# Altium schematic sheet STM32主控模块.SchDoc
size A3
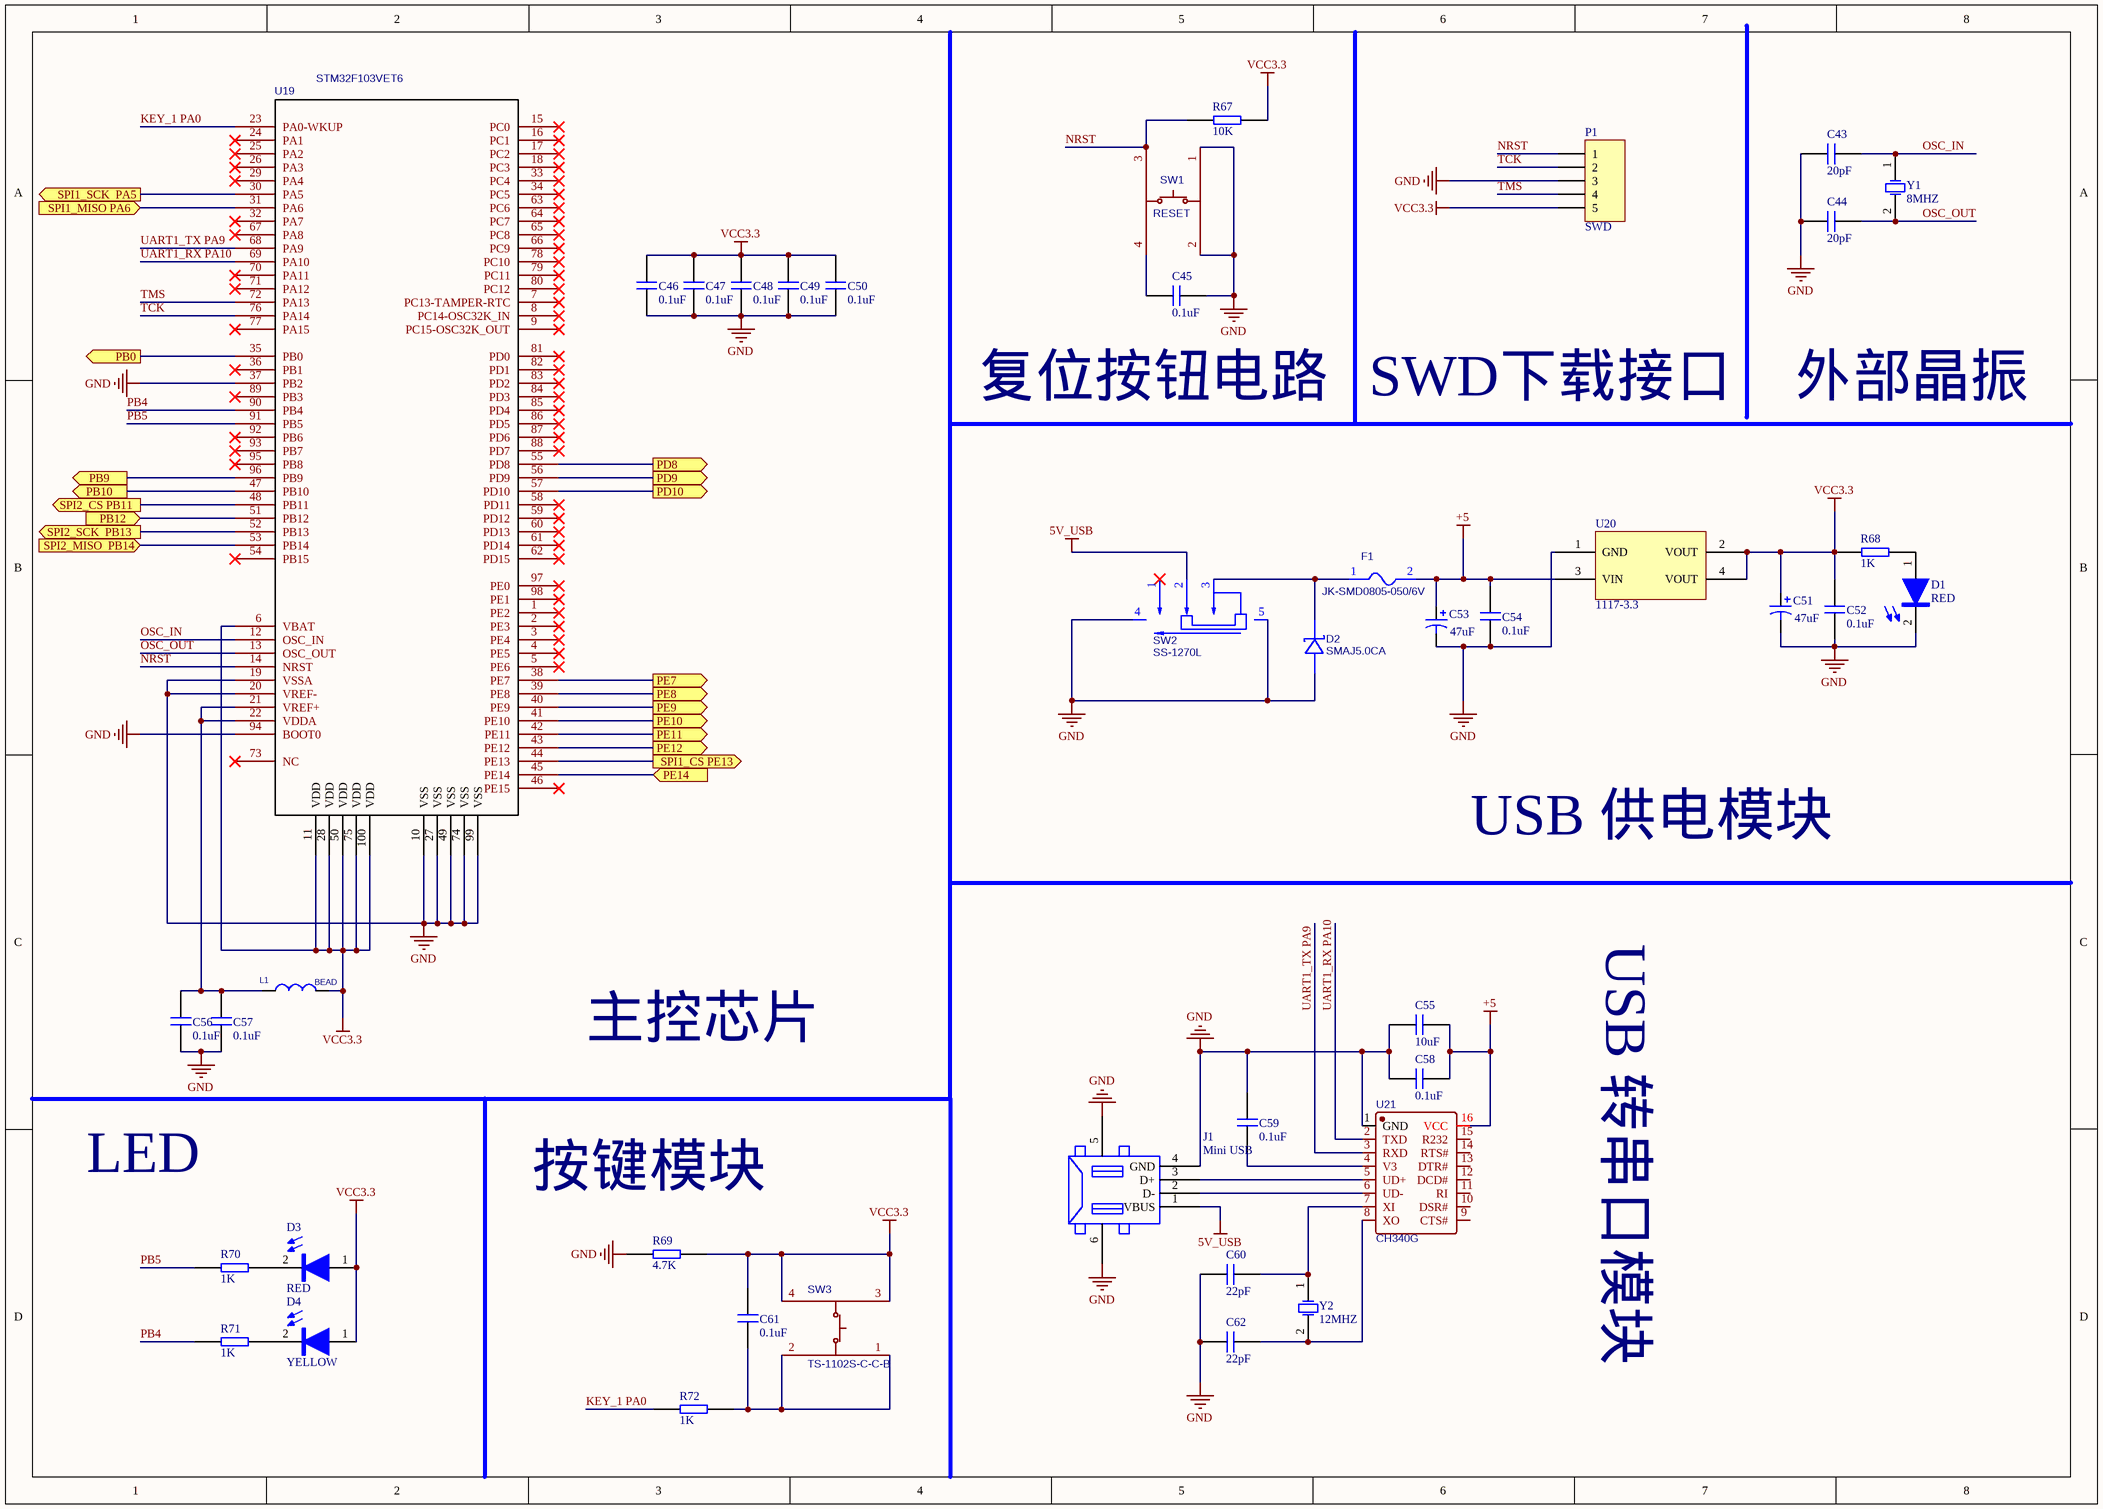
[diagram p0: STM32主控模块.SchDoc]

## Parts
C43  20pF  [0805C]
C44  20pF  [0805C]
C45  0.1uF  [0805C]
C46  0.1uF  [0805C]
C47  0.1uF  [0805C]
C48  0.1uF  [0805C]
C49  0.1uF  [0805C]
C50  0.1uF  [0805C]
C51  value 47uF  [CAP-SMD_BD6.3-L6.6-W6.6-LS7.2-FD]  (hidden comment: Cap Pol1)
C52  0.1uF  [0805C]
C53  value 47uF  [CAP-SMD_BD6.3-L6.6-W6.6-LS7.2-FD]  (hidden comment: Cap Pol1)
C54  0.1uF  [0805C]
C55  10uF  [0805C]
C56  0.1uF  [0805C]
C57  0.1uF  [0805C]
C58  0.1uF  [0805C]
C59  0.1uF  [0805C]
C60  22pF  [0603C]
C61  0.1uF  [0805C]
C62  22pF  [0603C]
D1  RED  [LED0603]
D2  SMAJ5.0CA  [SMA_L4.4-W2.6-LS5.0-RD]
D3  RED  [LED0603]
D4  YELLOW  [LED0603]
F1  JK-SMD0805-050/6V  [F0805]
J1  Mini USB  [USB-B-TH_U241-041N-1BR85-1]
L1  value BEAD  [L0603]  (hidden comment: BEAD-220/100MHZ-0603)
P1  SWD  [HDR1X5]
R67  10K  [0603R]
R68  1K  [0805R]
R69  4.7K  [0603R]
R70  1K  [0805R]
R71  1K  [0805R]
R72  1K  [0805R]
SW1  RESET  [KEY-SMD_4P-L6.0-W6.0-P4.50-LS9.5-BL]
SW2  SS-1270L  [SW-TH_SLD-12-501]
SW3  TS-1102S-C-C-B  [KEY-SMD_4P-L6.0-W6.0-P4.50-LS9.5-BL]
U19  STM32F103VET6  [STM32F103VET6-LQFP]
U20  1117-3.3  [SOT230P700X190-4N]
U21  CH340G  [SOIC-16_L9.9-W3.9-P1.27-LS6.0-BL]
Y1  8MHZ  [49SMD]
Y2  12MHZ  [HC-49US_L11.5-W4.5-P4.88]

## Ports
PB0 (out), PB9 (out), PB10 (out), PB12 (in), PD8 (out), PD9 (out), PD10 (out), PE7 (out), PE8 (out), PE9 (out), PE10 (out), PE11 (out), PE12 (out), PE14 (in), SPI1_CS PE13 (out), SPI1_MISO PA6 (in), SPI1_SCK  PA5 (out), SPI2_CS PB11 (out), SPI2_MISO  PB14 (in), SPI2_SCK  PB13 (out)

## Nets
5V_USB: J1.1(VBUS) SW2.2
+5: C53.1 C54.2 C55.1 C58.2 F1.2 U20.3(VIN) U21.16(VCC)
GND: C43.1 C44.1 C45.2 C46.1 C47.1 C48.1 C49.1 C50.1 C51.2 C52.1 C53.2 C54.1 C55.2 C56.1 C57.1 C58.1 C59.1 C60.1 C62.1 D1.2 D2.2(A) J1.4(GND) J1.5 J1.6 P1.3 R69.1 SW1.1 SW1.2 SW2.4 SW2.5 U19.10(VSS) U19.19(VSSA) U19.20(VREF-) U19.27(VSS) U19.37(PB2) U19.49(VSS) U19.74(VSS) U19.94(BOOT0) U19.99(VSS) U20.1(GND) U21.1(GND)
VCC3.3: C46.2 C47.2 C48.2 C49.2 C50.2 C51.1 C52.2 C61.2 D3.1 D4.1 L1.2 P1.5 R67.2 R68.1 R69.2 SW3.3 SW3.4 U19.6(VBAT) U19.11(VDD) U19.28(VDD) U19.50(VDD) U19.75(VDD) U19.100(VDD) U20.2(VOUT) U20.4(VOUT)
KEY_1 PA0: R72.1 U19.23(PA0-WKUP)
NRST: P1.1 R67.1 SW1.3 U19.14(NRST)
OSC_IN: C43.2 U19.12(OSC_IN) Y1.1(OSC1)
OSC_OUT: C44.2 U19.13(OSC_OUT) Y1.2(OSC2)
PB0: U19.35(PB0) ; port PB0
PB4: R71.1 U19.90(PB4)
PB5: R70.1 U19.91(PB5)
PB9: U19.96(PB9) ; port PB9
PB10: U19.47(PB10) ; port PB10
PB12: U19.51(PB12) ; port PB12
PD8: U19.55(PD8) ; port PD8
PD9: U19.56(PD9) ; port PD9
PD10: U19.57(PD10) ; port PD10
PE7: U19.38(PE7) ; port PE7
PE8: U19.39(PE8) ; port PE8
PE9: U19.40(PE9) ; port PE9
PE10: U19.41(PE10) ; port PE10
PE11: U19.42(PE11) ; port PE11
PE12: U19.43(PE12) ; port PE12
PE14: U19.45(PE14) ; port PE14
SPI1_CS PE13: U19.44(PE13) ; port SPI1_CS PE13
SPI1_MISO PA6: U19.31(PA6) ; port SPI1_MISO PA6
SPI1_SCK  PA5: U19.30(PA5) ; port SPI1_SCK  PA5
SPI2_CS PB11: U19.48(PB11) ; port SPI2_CS PB11
SPI2_MISO  PB14: U19.53(PB14) ; port SPI2_MISO  PB14
SPI2_SCK  PB13: U19.52(PB13) ; port SPI2_SCK  PB13
TCK: P1.2 U19.76(PA14)
TMS: P1.4 U19.72(PA13)
UART1_RX PA10: U19.69(PA10) U21.2(TXD)
UART1_TX PA9: U19.68(PA9) U21.3(RXD)
NetC45_1: C45.1 SW1.4
NetC56_2: C56.2 C57.2 L1.1 U19.21(VREF+) U19.22(VDDA)
NetC59_2: C59.2 U21.4(V3)
NetC60_2: C60.2 U21.7(XI) Y2.1(OSC1)
NetC61_1: C61.1 R72.2 SW3.1 SW3.2
NetC62_2: C62.2 U21.8(XO) Y2.2(OSC2)
NetD1_1: D1.1 R68.2
NetD2_1: D2.1(K) F1.1 SW2.3
NetD3_2: D3.2 R70.2
NetD4_2: D4.2 R71.2
NetJ1_2: J1.2(D-) U21.6(UD-)
NetJ1_3: J1.3(D+) U21.5(UD+)

Not connected (* = marked no-connect by the designer): SW2 1*; U19 1(PE2)* 2(PE3)* 3(PE4)* 4(PE5)* 5(PE6)* 7(PC13-TAMPER-RTC)* 8(PC14-OSC32K_IN)* 9(PC15-OSC32K_OUT)* 15(PC0)* 16(PC1)* 17(PC2)* 18(PC3)* 24(PA1)* 25(PA2)* 26(PA3)* 29(PA4)* 32(PA7)* 33(PC4)* 34(PC5)* 36(PB1)* 46(PE15)* 54(PB15)* 58(PD11)* 59(PD12)* 60(PD13)* 61(PD14)* 62(PD15)* 63(PC6)* 64(PC7)* 65(PC8)* 66(PC9)* 67(PA8)* 70(PA11)* 71(PA12)* 73(NC)* 77(PA15)* 78(PC10)* 79(PC11)* 80(PC12)* 81(PD0)* 82(PD1)* 83(PD2)* 84(PD3)* 85(PD4)* 86(PD5)* 87(PD6)* 88(PD7)* 89(PB3)* 92(PB6)* 93(PB7)* 95(PB8)* 97(PE0)* 98(PE1)*; U21 9(CTS#) 10(DSR#) 11(RI) 12(DCD#) 13(DTR#) 14(RTS#) 15(R232)

## Notes on the sheet
- 复位按钮电路
- SWD下载接口
- 外部晶振
- USB 供电模块
- USB 转串口模块
- 主控芯片
- LED
- 按键模块
- Title
- Size:
- Date:
- A3
- Number:
- Time:
- Revision:
- Sheet
- of
- File:

## Library data of the parts
C43 C44 = CAP: NPO高频电容
C45-C50 C52 C54-C62 = CAP: 普通电容
C51 C53 = Cap Pol1: Polarized Capacitor (Radial); Published: 8-Jun-2000; LatestRevisionDate: 17-Jul-2002; LatestRevisionNote: Re-released for DXP Platform.; PackageReference: RB7.6-15; Publisher: Altium Limited; PackageDescription: Polarized Capacitor (Radial); 2 Leads
D1 D3 D4 = LED: 发光二极管
D2 = SMAJ5.0CA_C116601: 稳压二极管; BOM_Manufacturer: MDD; BOM_Supplier: LCSC; BOM_Manufacturer Part: SMAJ5.0CA; BOM_Supplier Part: C116601; BOM_JLCPCB Part Class: Extended Part; spicePre: D; spiceSymbolName: SMAJ5.0CA_C116601
F1 = JK-SMD0805-050/6V: 500mA 保险丝; BOM_Manufacturer: JK(金科); Contributor: LCSC; BOM_Supplier: LCSC; BOM_Supplier Part: C2830231; BOM_Manufacturer Part: JK-SMD0805-050/6V; BOM_JLCPCB Part Class: Extended Part; spicePre: F; spiceSymbolName: JK-SMD0805-050/6V
J1 = Mini-B USB H: Mini A型USB母座
L1 = BEAD-220/100MHZ-0603: 0603,BEAD; Manufacturer #1 PN: BEAD; PCB DECAL: L0603
P1 = Header 5: Header, 5-Pin; LatestRevisionDate: 17-Jul-2002; LatestRevisionNote: Re-released for DXP Platform.; Publisher: Altium Limited
R67-R72 = RES: 电阻模型
SW1 = SW-PB: 轻触开关; BOM_Manufacturer: XKB Enterprise; BOM_Manufacturer Part: TS-1102S-C-C-B; Contributor: LCSC; BOM_Supplier: LCSC; BOM_Supplier Part: C381039; BOM_JLCPCB Part Class: Extended Part; spicePre: S; spiceSymbolName: TS-1102S-C-C-B
SW2 = SS-1270L: 拨动开关; BOM_Manufacturer: RI SHENG; Contributor: LCSC; BOM_Supplier: LCSC; BOM_Supplier Part: C589300; BOM_Manufacturer Part: SS-1270L; JLCPCB Part Class: Extended Part; BOM_JLCPCB Part Class: Extended Part; spicePre: S; spiceSymbolName: SS-1270L
SW3 = SW-PB: 轻触开关; BOM_Manufacturer: XKB Enterprise; Contributor: LCSC; BOM_Supplier: LCSC; BOM_Supplier Part: C381039; BOM_Manufacturer Part: TS-1102S-C-C-B; BOM_JLCPCB Part Class: Extended Part; spicePre: S; spiceSymbolName: TS-1102S-C-C-B
U19 = STM32F103VET6: BOM_Manufacturer: STMicroelectronics; BOM_Supplier: LCSC; BOM_Manufacturer Part: STM32F103VET6; BOM_Supplier Part: C8308; BOM_JLCPCB Part Class: Extended Part; spicePre: U; spiceSymbolName: STM32F103VET6
U20 = AMS1117-3.3: 线性稳压芯片
U21 = CH340G: USB转TTL芯片; BOM_Manufacturer: WCH; timeStamp: 1468327462; BOM_Supplier: LCSC; BOM_Manufacturer Part: CH340G; BOM_Supplier Part: C14267; BOM_JLCPCB Part Class: Extended Part; spicePre: U; spiceSymbolName: CH340G
Y1 Y2 = XTAL: Crystal Oscillator; Published: 8-Jun-2000; LatestRevisionDate: 17-Jul-2002; LatestRevisionNote: Re-released for DXP Platform.; PackageReference: R38; Publisher: Altium Limited; PackageDescription: Crystal, Thru-Hole; 2 Leads; Body 3.1 x 8.2 mm (Dia.xH)